# Altium schematic sheet DB10005_Controller.SchDoc: Controller
size A3; SheetNumber: 3; SheetTotal: 7
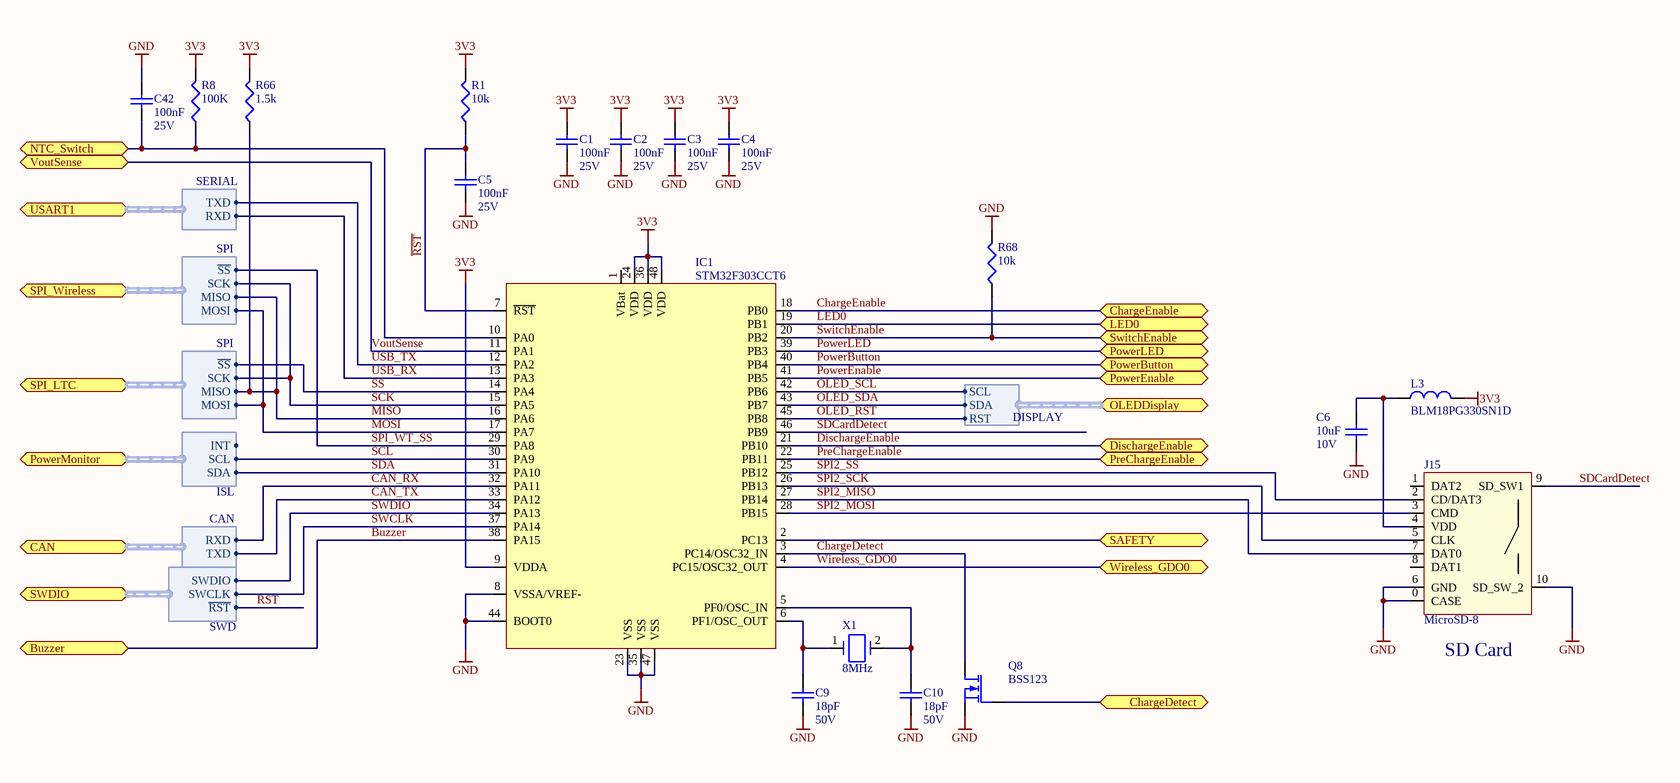
[diagram p0: DB10005_Controller.SchDoc]

## Parts
C1  100nF  Voltage Rating: 25V  [C0402]
C2  100nF  Voltage Rating: 25V  [C0402]
C3  100nF  Voltage Rating: 25V  [C0402]
C4  100nF  Voltage Rating: 25V  [C0402]
C5  100nF  Voltage Rating: 25V  [C0402]
C6  10uF  Voltage Rating: 10V  [C-0805]
C9  18pF  Voltage Rating: 50V  [C0402]
C10  18pF  Voltage Rating: 50V  [C0402]
C42  100nF  Voltage Rating: 25V  [C0402]
IC1  STM32F303CCT6  [LQFP48]
J15  MicroSD-8  [microSD]
L3  BLM18PG330SN1D  [L0603]
Q8  BSS123  [SOT-23]
R1  10k  [0402]
R8  100K  [0402]
R66  1.5k  [0402]
R68  10k  [0402]
X1  8MHz  [XTAL150SMD_125X196]

## Ports
Buzzer, CAN (harness CAN), ChargeDetect, ChargeEnable, DischargeEnable, LED0, NTC_Switch, OLEDDisplay (harness DISPLAY), PowerButton, PowerEnable, PowerLED, PowerMonitor (harness ISL), PreChargeEnable, SAFETY, SPI_LTC (harness SPI), SPI_Wireless (harness SPI), SWDIO (harness SWD), SwitchEnable, USART1 (harness SERIAL), VoutSense, Wireless_GDO0

## Harnesses
SERIAL: RXD, TXD
DISPLAY: SDA, SCL, RST
CAN: RXD, TXD
SPI: ~{SS}, SCK, MISO, MOSI
ISL: SDA, SCL, INT
SWD: SWCLK, SWDIO, ~{RST}

## Nets
3V3: C1.2 C2.2 C3.2 C4.2 IC1.9(VDDA) IC1.24(VDD) IC1.36(VDD) IC1.48(VDD) L3.2 R1.2 R8.2 R66.2
GND: C1.1 C2.1 C3.1 C4.1 C5.1 C6.1 C9.1 C10.1 C42.2 IC1.8(VSSA/VREF-) IC1.23(VSS) IC1.35(VSS) IC1.44(BOOT0) IC1.47(VSS) J15.0(CASE) J15.6(GND) J15.10(SD_SW_2) Q8.S R68.2
Buzzer: IC1.38(PA15) ; port Buzzer
CAN_RX: IC1.32(PA11) ; port CAN.RXD
CAN_TX: IC1.33(PA12) ; port CAN.TXD
ChargeDetect: IC1.3(PC14/OSC32_IN) Q8.D
ChargeDetect: Q8.G ; port ChargeDetect  [a separate net that carries the same name]
ChargeEnable: IC1.18(PB0) ; port ChargeEnable
DischargeEnable: IC1.21(PB10) ; port DischargeEnable
LED0: IC1.19(PB1) ; port LED0
MISO: IC1.16(PA6) R66.1 ; port SPI_LTC.MISO, port SPI_Wireless.MISO
MOSI: IC1.17(PA7) ; port SPI_LTC.MOSI, port SPI_Wireless.MOSI
NTC_Switch: C42.1 IC1.10(PA0) R8.1 ; port NTC_Switch
OLED_RST: IC1.45(PB8) ; port OLEDDisplay.RST
OLED_SCL: IC1.42(PB6) ; port OLEDDisplay.SCL
OLED_SDA: IC1.43(PB7) ; port OLEDDisplay.SDA
PowerButton: IC1.40(PB4) ; port PowerButton
PowerEnable: IC1.41(PB5) ; port PowerEnable
PowerLED: IC1.39(PB3) ; port PowerLED
PreChargeEnable: IC1.22(PB11) ; port PreChargeEnable
~{RST}: C5.2 IC1.7(~{RST}) R1.1 ; port SWDIO.~{RST}
~{SS}: IC1.14(PA4) ; port SPI_LTC.~{SS}
SAFETY: IC1.2(PC13) ; port SAFETY
SCK: IC1.15(PA5) ; port SPI_LTC.SCK, port SPI_Wireless.SCK
SCL: IC1.30(PA9) ; port PowerMonitor.SCL
SDA: IC1.31(PA10) ; port PowerMonitor.SDA
SDCardDetect: IC1.46(PB9) J15.9(SD_SW1)
SPI2_MISO: IC1.27(PB14) J15.7(DAT0)
SPI2_MOSI: IC1.28(PB15) J15.3(CMD)
SPI2_SCK: IC1.26(PB13) J15.5(CLK)
SPI2_SS: IC1.25(PB12) J15.2(CD/DAT3)
SPI_WT_SS: IC1.29(PA8) ; port SPI_Wireless.~{SS}
SWCLK: IC1.37(PA14) ; port SWDIO.SWCLK
SWDIO: IC1.34(PA13) ; port SWDIO.SWDIO
SwitchEnable: IC1.20(PB2) R68.1 ; port SwitchEnable
USB_RX: IC1.13(PA3) ; port USART1.RXD
USB_TX: IC1.12(PA2) ; port USART1.TXD
VoutSense: IC1.11(PA1) ; port VoutSense
Wireless_GDO0: IC1.4(PC15/OSC32_OUT) ; port Wireless_GDO0
NetC6_2: C6.2 J15.4(VDD) L3.1
NetC9_2: C9.2 IC1.6(PF1/OSC_OUT) X1.1
NetC10_2: C10.2 IC1.5(PF0/OSC_IN) X1.2

Not connected (* = marked no-connect by the designer): IC1 1(VBat); J15 1(DAT2) 8(DAT1)

## Notes on the sheet
- (near J15) SD Card
- Title
- Size:
- Date:
- A3
- Number:
- Time:
- Revision:
- Sheet
- of
- File:

## Library data of the parts
C1-C5 C42 = 100nF/0402/CER/25V: Capacitor, 100nF, 25V, X7R; Capacitance Tolerance: 10nF; Capacitor Case Style: 0402; Brand Number: GRM155R71E104KE14D; Brand: MULTICOMP; Dielectric Characteristic: X7R; Capacitance: 100nF; Temperature Range: -55 to +125 C; Price: 0,0225; Order Code Supplier: 2456106; Supplier: Farnell
C6 = 10uF/0805/CER/10V: Capacitor, 10uF, 10V, X7R; Capacitance Tolerance: ± 10%; Capacitor Case Style: 0805; Brand Number: GRM21BR71A106KE51L; Brand: MURATA; Dielectric Characteristic: X7R; Capacitance: 10uF; Temperature Range: -55°C to +125°C; Price: 0,36; Order Code Supplier: 1828828; Supplier: Farnell
C9 C10 = 18pF/0402/CER/50V: Capacitor, 18pF, 50V, NP0; Capacitance Tolerance: ± 5%; Capacitor Case Style: 0402; Brand Number: GRM1555C1H180JA01D; Brand: MURATA; Dielectric Characteristic: NP0; Capacitance: 18pF; Temperature Range: -55°C to 125°C; Price: 0,0177; Order Code Supplier: 1828876; Supplier: Farnell
IC1 = STM32F303CCT6: MCU, 32BIT CORTEX-M3, 72MHz; Brand: STM; Brand Number: STM32F303CCT6; Supplier: Farnell; Order Code Supplier: 2215113
J15 = MICRO-SD-PP-SDIO: Connector, Micro SD, Push/Push 8; Brand: MOLEX; Brand Number: 502774-0891; Case Style: 49225; Pitch: 1.10mm; Order Code Supplier: 2064063; Price: 2,45; Supplier: Farnell
L3 = BLM18PG330SN1D: Ferrite Bead, Impedance:33ohm, DC Resistance Max:0.025ohm, DC Current Rating:3A; Brand: MURATA; Case Style: 0603; Brand Number: BLM18PG330SN1D; Price: 0,048; Supplier: Farnell; Order Code Supplier: 1515742
Q8 = BSS123: Mosfet, N-channel, Vds:100V, Id:0.15A, Vgs-th:2.8V, Rds-on:3.5ohm; Brand: NXP; Drain Current: 0.15A; Drain Source Voltage: 100V; Gate Source Voltage: 20V; On Resistance: 3.5ohm; Threshold Voltage: 2.8V; Brand Number: BSS123; Case Style: SOT-23; Order Code Supplier: 1510764; Price: 0,082; Supplier: Farnell; Temperature Range: -55°C to +150°C; Transistor Polarity: N-channel
R1 R68 = 10k/0402/0063W/50V: Resistor, 10k, 0.1%, 0.0625W, 50V, 100PPM, 0402; Brand: VISHAY DRALORIC; Brand Number: CRCW040210K0FKED; Power Rating: 0.063W; Case Style: 0402; Order Code Supplier: 2121730; Price: 0,0005; Resistance: 10k; Supplier: Farnell; Temperature Coefficient: ± 100PPM; Temperature Range: -55°C to +125°C; Voltage Rating: 50V
R8 = 100k/0402/0063W/50V: Resistor, 100k, 0.1%, 0.0625W, 50V, 100PPM, 0402; Brand: VISHAY DRALORIC; Brand Number: CRCW0402100KFKED; Power Rating: 0.063W; Case Style: 0402; Order Code Supplier: 2121857; Price: 0,0004; Resistance: 100K; Supplier: Farnell; Temperature Coefficient: ± 100PPM; Temperature Range: -55°C to +125°C; Voltage Rating: 50V
R66 = 1.5k/0402/0063W/50V: Resistor, 1.5k, 0.1%, 0.0625W, 50V, 100PPM, 0402; Brand: VISHAY DRALORIC; Brand Number: CRCW04021K50FKED; Power Rating: 0.063W; Case Style: 0402; Order Code Supplier: 2121624; Price: 0,0054; Resistance: 1.5k; Supplier: Farnell; Temperature Coefficient: ± 100PPM; Temperature Range: -55°C to +125°C; Voltage Rating: 50V
X1 = ABM3-8.000MHZ-D2Y-T: 8MHZ, 18PF, 5 X 3.2MM; Brand: ABRACON; Brand Number: ABM3-8.000MHZ-D2Y-T; Order Code Supplier: 2101329; Price: 0,90; Supplier: Farnell